# Altium schematic sheet dwm1001.SchDoc
size A
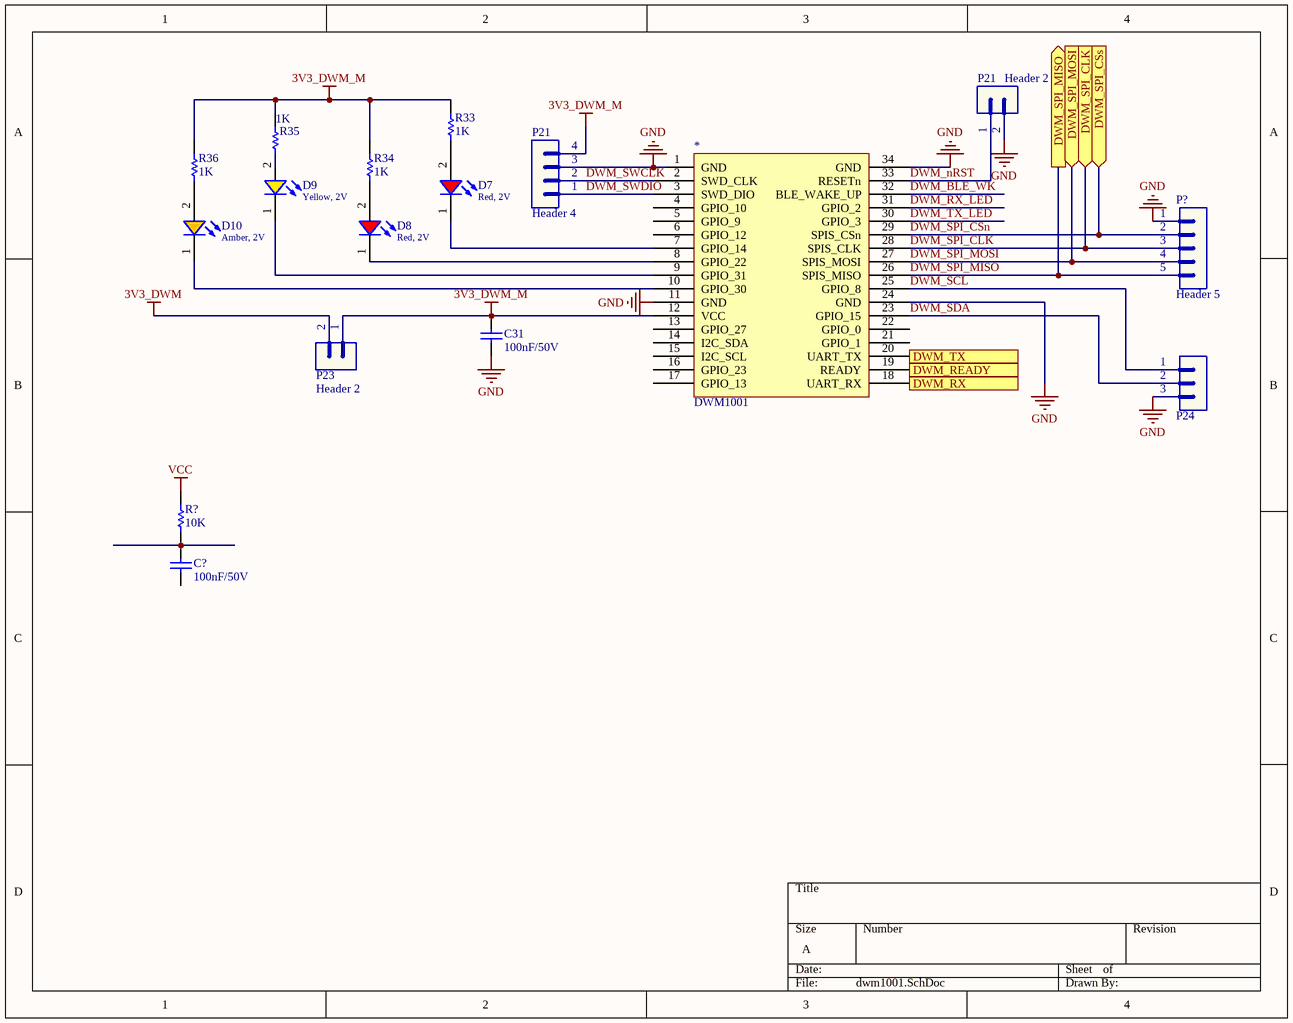
[diagram p0: dwm1001.SchDoc]

## Parts
*  DWM1001  [DWM1001]
?  Header 4  [JP4]
C31  value 100nF/50V  [CAP-SM-0805]  (hidden comment: Cap-100nF-50V-0805)
C?  value 100nF/50V  [CAP-SM-0805]  (hidden comment: Cap-100nF-50V-0805)
D7  Red, 2V  [WL-SMCW_0603_H=0.25mm]
D8  Red, 2V  [WL-SMCW_0603_H=0.25mm]
D9  Yellow, 2V  [WL-SMCW_0603_H=0.25mm]
D10  Amber, 2V  [WL-SMCW_0603_H=0.25mm]
P21  Header 2  [JP2]
P23  Header 2  [JP2]
P24  Header 3  [JP3]  (value not drawn)
P?  Header 5  [JP5]
R33  value 1K  [RES-SM-0805]  (hidden comment: Res-1K-0805)
R34  value 1K  [RES-SM-0805]  (hidden comment: Res-1K-0805)
R35  value 1K  [RES-SM-0805]  (hidden comment: Res-1K-0805)
R36  value 1K  [RES-SM-0805]  (hidden comment: Res-1K-0805)
R?  value 10K  [RES-SM-0805]  (hidden comment: Res-10k-0805)

## Ports
DWM_READY (out), DWM_RX (in), DWM_SPI_CLK (in), DWM_SPI_CSs (in), DWM_SPI_MISO (out), DWM_SPI_MOSI (in), DWM_TX (out)

## Nets
3V3_DWM: P23.2
3V3_DWM_M: *.12(VCC) ?.4 C31.2 P23.1 R33.2 R34.2 R35.2 R36.2
GND: *.1(GND) *.11(GND) *.24(GND) *.34(GND) ?.3 C31.1 P21.2 P24.3 P?.1
VCC: R?.2
DWM_BLE_WK: *.32(BLE_WAKE_UP)
DWM_nRST: *.33(RESETn) P21.1
DWM_READY: *.19(READY) ; port DWM_READY
DWM_RX: *.18(UART_RX) ; port DWM_RX
DWM_RX_LED: *.31(GPIO_2)
DWM_SCL: *.25(GPIO_8) P24.1
DWM_SDA: *.23(GPIO_15) P24.2
DWM_SPI_CLK: *.28(SPIS_CLK) P?.3 ; port DWM_SPI_CLK
DWM_SPI_CSn: *.29(SPIS_CSn) P?.2 ; port DWM_SPI_CSs
DWM_SPI_MISO: *.26(SPIS_MISO) P?.5 ; port DWM_SPI_MISO
DWM_SPI_MOSI: *.27(SPIS_MOSI) P?.4 ; port DWM_SPI_MOSI
DWM_SWCLK: *.2(SWD_CLK) ?.2
DWM_SWDIO: *.3(SWD_DIO) ?.1
DWM_TX: *.20(UART_TX) ; port DWM_TX
DWM_TX_LED: *.30(GPIO_3)
Net*_7: *.7(GPIO_14) D7.1(K)
Net*_8: *.8(GPIO_22) D8.1(K)
Net*_9: *.9(GPIO_31) D9.1(K)
Net*_10: *.10(GPIO_30) D10.1(K)
NetC?_2: C?.2 R?.1
NetD7_2: D7.2(A) R33.1
NetD8_2: D8.2(A) R34.1
NetD9_2: D9.2(A) R35.1
NetD10_2: D10.2(A) R36.1

Not connected (* = marked no-connect by the designer): * 4(GPIO_10) 5(GPIO_9) 6(GPIO_12) 13(GPIO_27) 14(I2C_SDA) 15(I2C_SCL) 16(GPIO_23) 17(GPIO_13) 21(GPIO_1) 22(GPIO_0); C? 1

## Notes on the sheet
- P21

## Library data of the parts
? = Header 4: Header, 4-Pin; LatestRevisionDate: 17-Jul-2002; LatestRevisionNote: Re-released for DXP Platform.; Publisher: Altium Limited
C31 C? = Cap-100nF-50V-0805: CAP CER 0.1UF 50V Y5V 0805; Manufacturer: Samsung Electro-Mechanics; Manufacturer Part Number: CL21F104ZBCNNNC; Local Supplier: thegioiic; Local Supplier Link: https://thegioiic.com/products/tu-100nf-0-1uf-50v-0805; Supplier 1: Digikey; Supplier 1 Part Number: 1276-1007-1-ND; Supplier 1 Link: https://www.digikey.com/product-detail/en/samsung-electro-mechanics/CL21F104ZBCNNNC/1276-1007-1-ND/3889093
D7 D8 = 150060RS75020: WL-SMCW SMT Mono-color Chip LED Waterclear, size 0603, Red, 2V, 140deg; Chip Technology: AlInGaP; Dominant Wavelength typ.: 625nm; Luminous Intensity typ.: 100mcd; Peak Wavelength typ.: 630nm; Viewing Angle: 140deg; ComponentLink1Description: Manufacturer; ComponentLink1URL: http://www.we-online.de; ComponentLink2URL: https://www.we-online.com/catalog/datasheet/150060RS75020.pdf; ComponentLink2Description: Datasheet; Forward Voltage typ.: 2V; Emitting Color: Red; Mounting Technology: SMT; Operating Temperature: -40 to +85degC; Published Date: March 2020; Part Number: 150060RS75020; Packaging: Tape and Reel; Size: 0603; Publisher: Wurth Elektronik
D9 = 150060YS75020: WL-SMCW SMT Mono-color Chip LED Waterclear, size 0603, Yellow, 2V, 140deg; Chip Technology: AlInGaP; Dominant Wavelength typ.: 590nm; Luminous Intensity typ.: 130mcd; Peak Wavelength typ.: 595nm; Viewing Angle: 140deg; ComponentLink1Description: Manufacturer; ComponentLink1URL: http://www.we-online.de; ComponentLink2URL: https://www.we-online.com/catalog/datasheet/150060YS75020.pdf; ComponentLink2Description: Datasheet; Forward Voltage typ.: 2V; Emitting Color: Yellow; Mounting Technology: SMT; Operating Temperature: -40 to +85degC; Published Date: March 2020; Part Number: 150060YS75020; Packaging: Tape and Reel; Size: 0603; Publisher: Wurth Elektronik
D10 = 150060AS75020: WL-SMCW SMT Mono-color Chip LED Waterclear, size 0603, Amber, 2V, 140deg; Chip Technology: AlInGaP; Dominant Wavelength typ.: 605nm; Luminous Intensity typ.: 140mcd; Peak Wavelength typ.: 610nm; Viewing Angle: 140deg; ComponentLink1Description: Manufacturer; ComponentLink1URL: http://www.we-online.de; ComponentLink2URL: https://www.we-online.com/catalog/datasheet/150060AS75020.pdf; ComponentLink2Description: Datasheet; Forward Voltage typ.: 2V; Emitting Color: Amber; Mounting Technology: SMT; Operating Temperature: -40 to +85degC; Published Date: March 2020; Part Number: 150060AS75020; Packaging: Tape and Reel; Size: 0603; Publisher: Wurth Elektronik
P21 P23 = Header 2: Header, 2-Pin; LatestRevisionDate: 17-Jul-2002; LatestRevisionNote: Re-released for DXP Platform.; Publisher: Altium Limited
P24 = Header 3: Header, 3-Pin; LatestRevisionDate: 17-Jul-2002; LatestRevisionNote: Re-released for DXP Platform.; Publisher: Altium Limited
P? = Header 5: Header, 5-Pin; LatestRevisionDate: 17-Jul-2002; LatestRevisionNote: Re-released for DXP Platform.; Publisher: Altium Limited
R33-R36 = Res-1K-0805: RES 1K OHM 1% 1/4W 0805; Manufacturer: Stackpole Electronics Inc; Manufacturer Part Number: RNCP0805FTD1K00; Local Supplier: thegioiic; Local Supplier Link: https://thegioiic.com/products/dien-tro-1k-ohm-0805-5; Supplier 1: Digikey; Supplier 1 Link: https://www.digikey.com/product-detail/en/stackpole-electronics-inc/RNCP0805FTD1K00/RNCP0805FTD1K00CT-ND/2240568; Supplier 1 Part Number: RNCP0805FTD1K00CT-ND
R? = Res-10k-0805: RES 10K OHM 1% 1/4W 0805; Manufacturer: Stackpole Electronics Inc; Manufacturer Part Number: RNCP0805FTD10K0; Local Supplier: thegioiic; Local Supplier Link: https://thegioiic.com/products/dien-tro-10k-ohm-0805-5; Supplier 1: Digikey; Supplier 1 Link: https://www.digikey.com/product-detail/en/stackpole-electronics-inc/RNCP0805FTD10K0/RNCP0805FTD10K0CT-ND/2240601; Supplier 1 Part Number: RNCP0805FTD10K0CT-ND